# Altium schematic sheet root.SchDoc: Helmet HUD: Mainboard
size A4; Author: Kenny Wakaba; CompanyName: IGEN 330: Helmet HUD; DrawnBy: Kenny Wakaba; Engineer: Kenny Wakaba; SheetNumber: 1; SheetTotal: 1
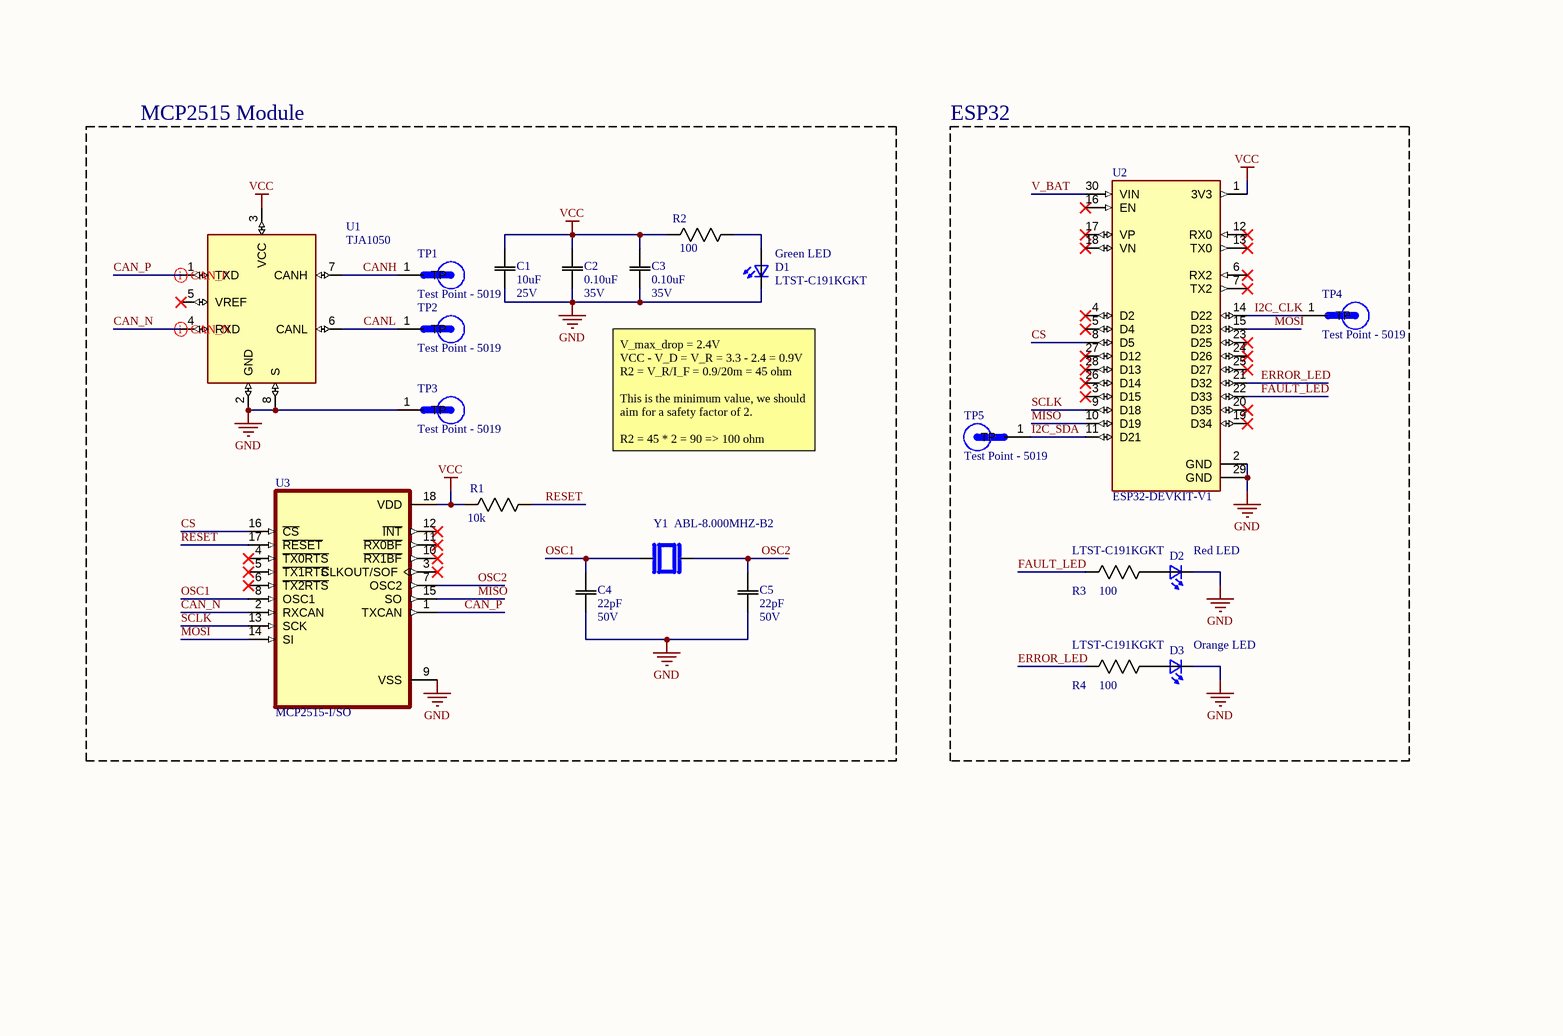
[diagram p0: root.SchDoc]

## Parts
C1  Rating: 25V  [1206]  (hidden comment: 10uF)
C2  Rating: 35V  [0805]  (hidden comment: 0.10uF)
C3  Rating: 35V  [0805]  (hidden comment: 0.10uF)
C4  Rating: 50V  [0805]  (hidden comment: 22pF)
C5  Rating: 50V  [0805]  (hidden comment: 22pF)
D1  LTST-C191KGKT  [0603]
D2  LTST-C191KGKT  [0603]
D3  LTST-C191KGKT  [0603]
R1  10k  [0603]
R2  100  [0603]
R3  100  [0603]
R4  100  [0603]
TP1  Test Point - 5019  [TP380X203]
TP2  Test Point - 5019  [TP380X203]
TP3  Test Point - 5019  [TP380X203]
TP4  Test Point - 5019  [TP380X203]
TP5  Test Point - 5019  [TP380X203]
U1  TJA1050  [SOP8]
U2  ESP32-DEVKIT-V1  [MODULE_ESP32_DEVKIT_V1]
U3  MCP2515-I/SO  [SOIC127P1030X265-18N]
Y1  ABL-8.000MHZ-B2  [XTAL_HC49P488W46L1150T500H350]

## Blocks framed on the sheet
MCP2515 Module: C1-C5 D1 R1 R2 TP1-TP3 U1 U3 Y1
ESP32: D2 D3 R3 R4 TP4 TP5 U2

## Nets
GND: C1.1(C1) C2.1(C1) C3.1(C1) C4.1(C1) C5.1(C1) D1.1(K2) D2.1(K2) D3.1(K2) TP3.1(TP) U1.2(GND) U1.8(S) U2.2(GND) U2.29(GND) U3.9(VSS)
VCC: C1.2(C2) C2.2(C2) C3.2(C2) R1.2(R2) R2.2(R2) U1.3(VCC) U2.1(3V3) U3.18(VDD)
CAN_N: U1.4(RXD) U3.2(RXCAN)
CAN_P: U1.1(TXD) U3.1(TXCAN)
CANH: TP1.1(TP) U1.7(CANH)
CANL: TP2.1(TP) U1.6(CANL)
CS: U2.8(D5) U3.16(~{CS})
ERROR_LED: R4.2(R2) U2.21(D32)
FAULT_LED: R3.2(R2) U2.22(D33)
I2C_CLK: TP4.1(TP) U2.14(D22)
I2C_SDA: TP5.1(TP) U2.11(D21)
MISO: U2.10(D19) U3.15(SO)
MOSI: U2.15(D23) U3.14(SI)
OSC1: C4.2(C2) U3.8(OSC1) Y1.1
OSC2: C5.2(C2) U3.7(OSC2) Y1.2
RESET: R1.1(R1) U3.17(~{RESET})
SCLK: U2.9(D18) U3.13(SCK)
V_BAT: U2.30(VIN)
NetD1_2: D1.2(A2) R2.1(R1)
NetD2_2: D2.2(A2) R3.1(R1)
NetD3_2: D3.2(A2) R4.1(R1)

Not connected (* = marked no-connect by the designer): U1 5(VREF)*; U2 3(D15)* 4(D2)* 5(D4)* 6(RX2)* 7(TX2)* 12(RX0)* 13(TX0)* 16(EN)* 17(VP)* 18(VN)* 19(D34)* 20(D35)* 23(D25)* 24(D26)* 25(D27)* 26(D14)* 27(D12)* 28(D13)*; U3 3(CLKOUT/SOF)* 4(~{TX0RTS})* 5(~{TX1RTS})* 6(~{TX2RTS})* 10(~{RX1BF})* 11(~{RX0BF})* 12(~{INT})*

## Layout directives
differential pair: CAN_N, CAN_P

## Notes on the sheet
- (near D1) Green LED
- V_max_drop = 2.4V
  VCC - V_D = V_R = 3.3 - 2.4 = 0.9V
  R2 = V_R/I_F = 0.9/20m = 45 ohm
  This is the minimum value, we should aim for a safety factor of 2.
  R2 = 45 * 2 = 90 => 100 ohm
- (near D2) Red LED
- (near D3) Orange LED

## Library data of the parts
C1 = CAP 10uF 25V: Default Symbol for Capacitors; Temperature Coefficient: X5R; Tolerance: 10%; Value: 10uF; Part Number: CAP 10uF 25V
C2 C3 = CAP 0.10uF 35V: CAP CER 0.10UF 35V X7R 0805; Manufacturer Part Number 1: GMK107B7104KAHT; Tolerance: 10%; Package: 0805; Temperature Coefficient: X7R; Operating Temperature: -55°C ~ 125°C; Value: 0.10uF; Part Number: CAP 0.10uF 35V; Supplier 1: Digi-Key; Supplier Part Number 1: 587-3354-1-ND; Manufacturer Part Number 2: GMK212BJ104KGHT; Supplier 2: Digi-Key; Supplier Part Number 2: 587-3364-1-ND
C4 C5 = CAP 22pF 50V: Default Symbol for Capacitors; Temperature Coefficient: X7R; Tolerance: 10%; Value: 22pF; Part Number: CAP 22pF 50V
D1-D3 = LTST-C191KGKT: Green 571nm LED Indication - Discrete 2V 0603 (1608 Metric); MF: Lite-On Inc.; Value: *; SnapEDA_Link: https://www.snapeda.com/parts/LTST-C191KGKT/Lite-On+Inc./view-part/?ref=snap; Purchase-URL: https://pricing.snapeda.com/search/part/LTST-C191KGKT/?ref=eda; Check_prices: https://www.snapeda.com/parts/LTST-C191KGKT/Lite-On+Inc./view-part/?ref=eda; Digi-Key_Part_Number: 160-1446-2-ND; Package: 0603 Lite-On Inc.; MP: LTST-C191KGKT
R1 = RES 10k 1/8W - 1%: RES SMD 10K OHM 1% 1/8W 0603; Manufacturer Part Number 1: ERJ-H3GJ103V; Power (Watts): 0.125W; Tolerance: 5%; Package: 0805; Value: 10k; Part Number: RES 10k 1/8W - 1%; Supplier 1: Digi-Key; Supplier Part Number 1: 10-ERJ-H3GJ103VCT-ND; Supplier URL 1: https://www.digikey.ca/en/products/detail/panasonic-electronic-components/ERJ-H3GJ103V/13877876?s=N4IgTCBcDaIIwAYC0BRASgKSQCQMwHENFcA1AYQBUkA5AERAF0BfIA; Manufacturer Part Number 2: RMCF0805JT10K0; Supplier 2: Digi-Key; Supplier Part Number 2: RMCF0805JT10K0CT-ND; Supplier URL 2: https://www.digikey.ca/en/products/detail/stackpole-electronics-inc/RMCF0805JT10K0/1757762?s=N4IgTCBcDaIEoFkDCAxADADjQVgFIBUBGNAaTSXxAF0BfIA; Tolerance 2: 5%
R2-R4 = RES 100.0 1/8W - 5%: Default Resistor Symbol; Manufacturer Part Number 1: RK73B1JRTTD101J; Power (Watts): 0.125W; Tolerance: 5%; Package: 0805; Value: 100; Part Number: RES 100.0 1/8W - 5%; Supplier 1: Digi-Key; Supplier Part Number 1: 2019-RK73B1JRTTD101JCT-ND; Supplier URL 1: https://www.digikey.ca/en/products/detail/koa-speer-electronics-inc/RK73B1JRTTD101J/12156165?s=N4IgTCBcDaIEoGkDsBmAQgRgFJwCq4BEMAGbAYVxAF0BfIA; Manufacturer Part Number 2: RMCF0805JT100R; Supplier 2: Digi-Key; Supplier Part Number 2: RMCF0805JT100RCT-ND; Supplier URL 2: https://www.digikey.ca/en/products/detail/stackpole-electronics-inc/RMCF0805JT100R/1757756?s=N4IgTCBcDaIEoFkDCAxADADjQVgFIBUBGNNOJfEAXQF8g; Tolerance 2: 5%
TP1-TP5 = Test Point - 5019: PC Test Point, Miniature Phosphor Bronze, Silver Plating Surface Mount Mounting Type; MP: 5019; MF: Keystone Electronics; Value: *; Package: 2010 Keystone; Part Number: Test Point - 5019
U1 = TJA1050: 1/1 Transceiver Half CANbus 8-SO; MF: NXP USA; Package: SOIC-8 NXP Semiconductors; MP: TJA1050; Purchase-URL: https://pricing.snapeda.com/search/part/TJA1050/?ref=eda; SnapEDA_Link: https://www.snapeda.com/parts/TJA1050/NXP%20USA%20Inc./view-part/562764/?ref=snap; Check_prices: https://www.snapeda.com/parts/TJA1050/NXP%20USA%20Inc./view-part/562764/?ref=eda; Price: None; Value: *; Availability: In Stock
U2 = ESP32-DEVKIT-V1: Dual core, Wi-Fi: 2.4 GHz up to 150 Mbits/s,BLE (Bluetooth Low Energy) and legacy Bluetooth, 32 bits, Up to 240 MHz; MF: Do it; Price: None; Availability: Not in stock; Package: None; MP: ESP32-DEVKIT-V1; Value: *; SnapEDA_Link: https://www.snapeda.com/parts/ESP32-DEVKIT-V1/Do+it/view-part/?ref=snap; Check_prices: https://www.snapeda.com/parts/ESP32-DEVKIT-V1/Do+it/view-part/?ref=eda
U3 = MCP2515-I/SO: CANbus Controller CAN 2.0 SPI Interface 18-SOIC; MF: Microchip; Package: SOIC-18 Microchip; Value: *; Price: None; MP: MCP2515-I/SO; Availability: Unavailable; SnapEDA_Link: https://www.snapeda.com/parts/MCP2515-I/SO/Microchip/view-part/50301/?ref=snap
Y1 = ABL-8.000MHZ-B2: HC/49US (AT49) MICROPROCESSOR CRYSTAL; MF: Abracon; Check_prices: https://www.snapeda.com/parts/ABL-8.000MHZ-B2/Abracon+LLC/view-part/?ref=eda; Package: HC-49/US ABRACON; MP: ABL-8.000MHZ-B2; Value: *; SnapEDA_Link: https://www.snapeda.com/parts/ABL-8.000MHZ-B2/Abracon+LLC/view-part/?ref=snap; Availability: In Stock; Price: None; Purchase-URL: https://pricing.snapeda.com/search/part/ABL-8.000MHZ-B2/?ref=eda